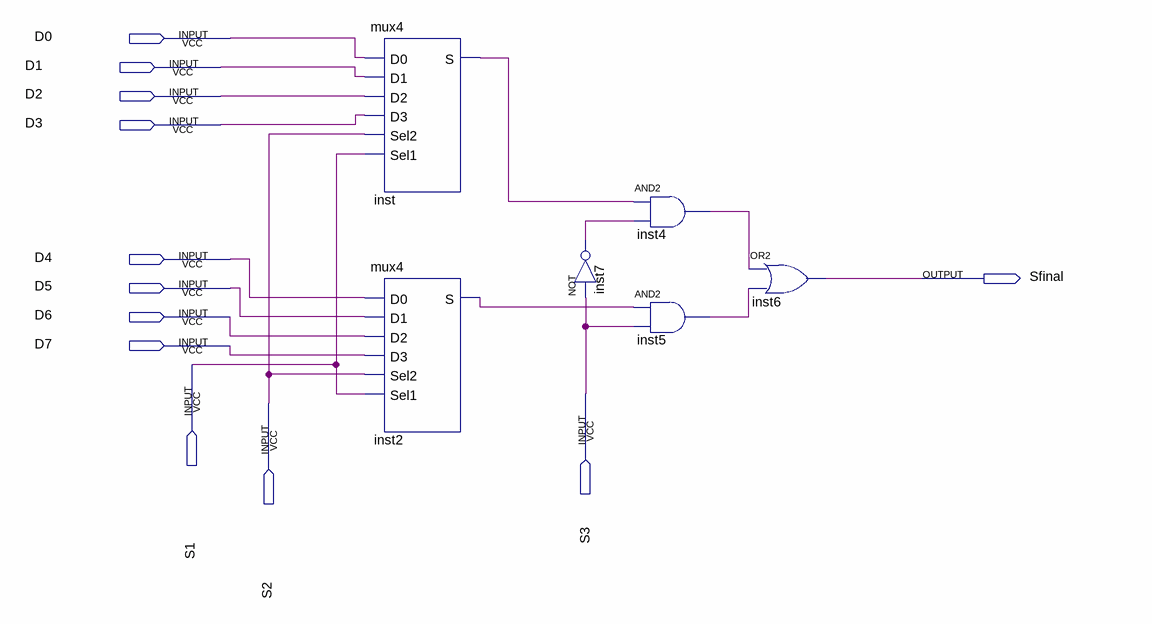
[diagram p0: schematic sheet]
// Quartus schematic mux8.bdf as structural Verilog: 6 symbols, 12 pins
module mux8 (
  input  D0,
  input  D1,
  input  D2,
  input  D3,
  input  D4,
  input  D5,
  input  D6,
  input  D7,
  input  S1,
  input  S3,
  input  S2,
  output Sfinal
);

  wire inst2_s, inst4_out, inst5_out, inst7_out, inst_s;

  mux4 inst (.D0(D0), .D1(D1), .D2(D2), .D3(D3), .Sel2(S2), .Sel1(S1), .S(inst_s));
  mux4 inst2 (.D0(D4), .D1(D5), .D2(D6), .D3(D7), .Sel2(S2), .Sel1(S1), .S(inst2_s));
  not inst7 (inst7_out, S3);
  and inst4 (inst4_out, inst_s, inst7_out);
  and inst5 (inst5_out, inst2_s, S3);
  or inst6 (Sfinal, inst4_out, inst5_out);
endmodule
